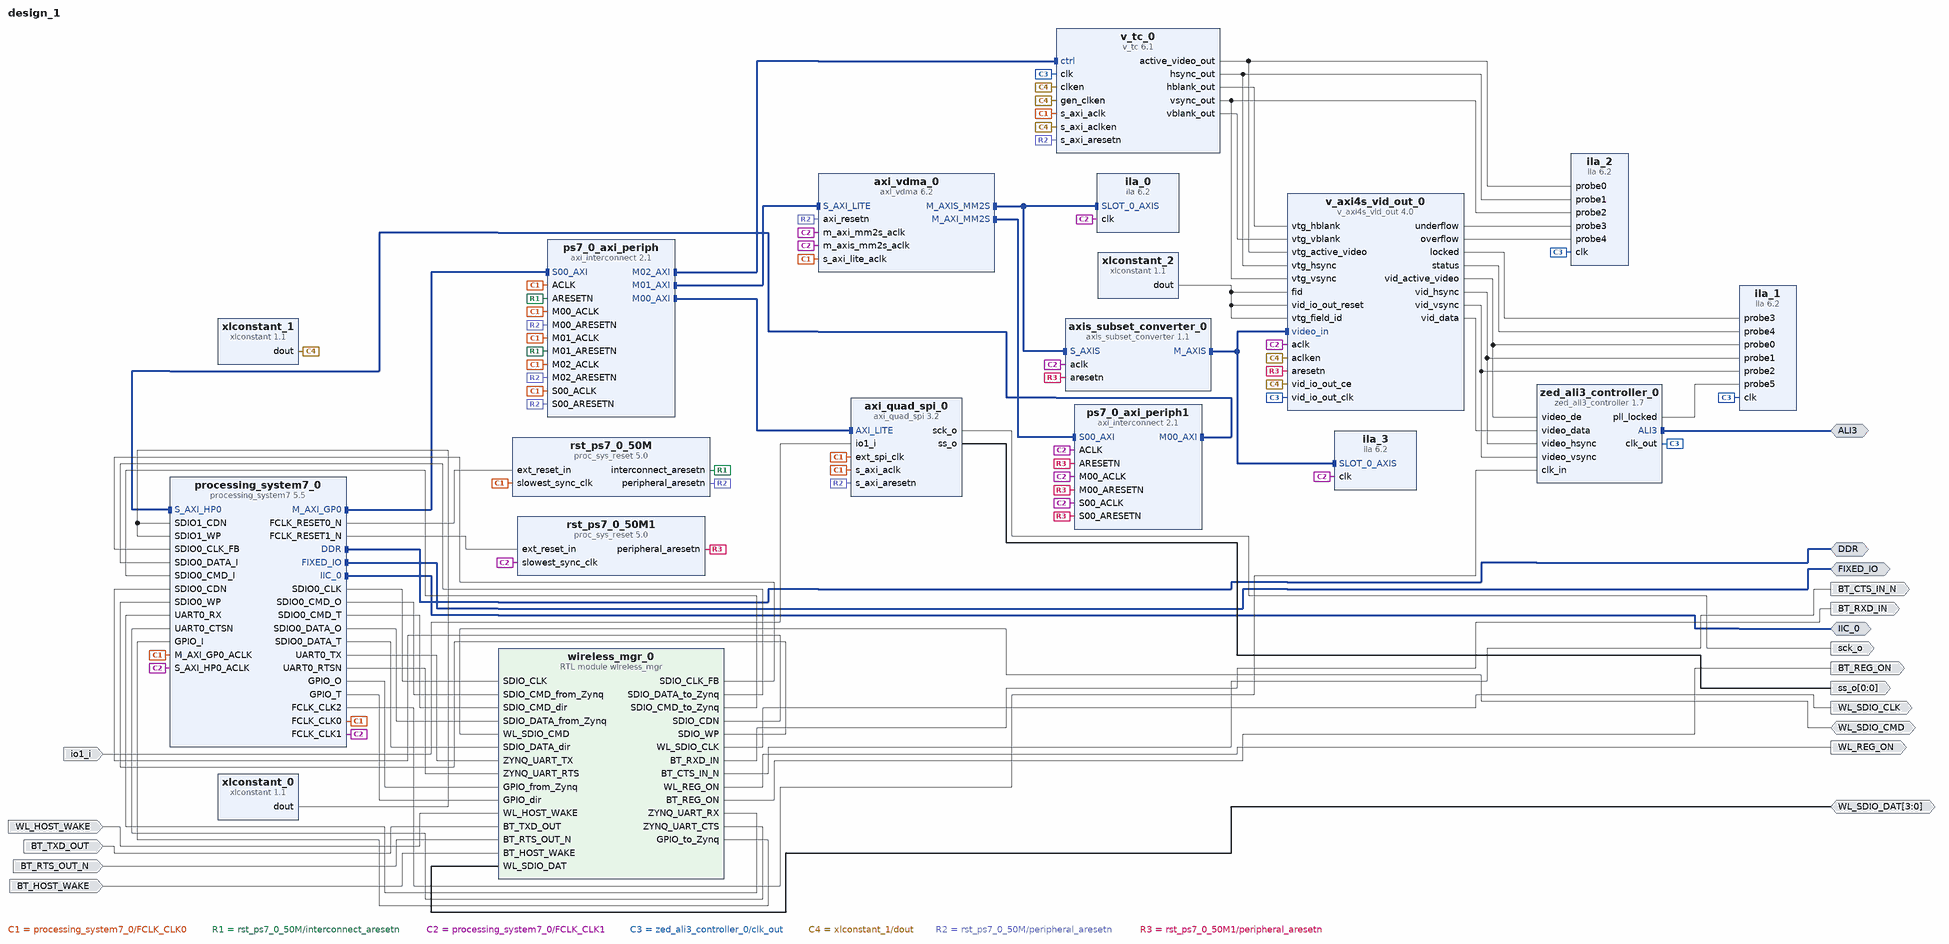
[diagram p0: block diagram of the top level]
# Vivado block design design_1, xc7z007sclg225-1, Vivado 2016.4
create_bd_design design_1

create_bd_intf_port -mode Master -vlnv xilinx.com:interface:ddrx_rtl:1.0 DDR
create_bd_intf_port -mode Master -vlnv xilinx.com:display_processing_system7:fixedio_rtl:1.0 FIXED_IO
create_bd_intf_port -mode Master -vlnv xilinx.com:interface:iic_rtl:1.0 IIC_0
create_bd_intf_port -mode Master -vlnv avnet.com:interface:avnet_ali3_rtl:1.0 ALI3
create_bd_port -dir I WL_HOST_WAKE
create_bd_port -dir I BT_TXD_OUT
create_bd_port -dir I BT_RTS_OUT_N
create_bd_port -dir I BT_HOST_WAKE
create_bd_port -dir O -type clk WL_SDIO_CLK
create_bd_port -dir IO WL_SDIO_CMD
create_bd_port -dir IO -from 3 -to 0 WL_SDIO_DAT
create_bd_port -dir O WL_REG_ON
create_bd_port -dir O BT_RXD_IN
create_bd_port -dir O BT_CTS_IN_N
create_bd_port -dir O BT_REG_ON
create_bd_port -dir I io1_i
create_bd_port -dir O sck_o
create_bd_port -dir O -from 0 -to 0 ss_o

create_bd_cell -type ip -vlnv xilinx.com:ip:processing_system7:5.5 processing_system7_0
set_property -dict [list \
  CONFIG.PCW_FCLK_CLK1_BUF TRUE \
  CONFIG.PCW_FCLK_CLK2_BUF TRUE \
  CONFIG.PCW_FCLK_CLK3_BUF TRUE \
  CONFIG.PCW_UIPARAM_DDR_FREQ_MHZ 533.333333 \
  CONFIG.PCW_APU_PERIPHERAL_FREQMHZ 666.666666 \
  CONFIG.PCW_SDIO_PERIPHERAL_FREQMHZ 25 \
  CONFIG.PCW_UART_PERIPHERAL_FREQMHZ 100 \
  CONFIG.PCW_I2C_PERIPHERAL_FREQMHZ 111.111115 \
  CONFIG.PCW_FPGA0_PERIPHERAL_FREQMHZ 50 \
  CONFIG.PCW_FPGA1_PERIPHERAL_FREQMHZ 50 \
  CONFIG.PCW_FPGA2_PERIPHERAL_FREQMHZ 33.3333 \
  CONFIG.PCW_FPGA3_PERIPHERAL_FREQMHZ 200 \
  CONFIG.PCW_USE_S_AXI_HP0 1 \
  CONFIG.PCW_USE_FABRIC_INTERRUPT 1 \
  CONFIG.PCW_GPIO_EMIO_GPIO_WIDTH 4 \
  CONFIG.PCW_DQ_WIDTH 16 \
  CONFIG.PCW_DQS_WIDTH 2 \
  CONFIG.PCW_DM_WIDTH 2 \
  CONFIG.PCW_MIO_PRIMITIVE 32 \
  CONFIG.PCW_EN_CLK1_PORT 1 \
  CONFIG.PCW_EN_CLK2_PORT 1 \
  CONFIG.PCW_EN_CLK3_PORT 1 \
  CONFIG.PCW_EN_RST1_PORT 1 \
  CONFIG.PCW_EN_RST2_PORT 1 \
  CONFIG.PCW_IRQ_F2P_INTR 1 \
  CONFIG.PCW_PRESET_BANK1_VOLTAGE {LVCMOS 3.3V} \
  CONFIG.PCW_UIPARAM_DDR_MEMORY_TYPE {DDR 3 (Low Voltage)} \
  CONFIG.PCW_UIPARAM_DDR_BUS_WIDTH {16 Bit} \
  CONFIG.PCW_UIPARAM_DDR_PARTNO {MT41K256M16 RE-125} \
  CONFIG.PCW_QSPI_PERIPHERAL_ENABLE 1 \
  CONFIG.PCW_QSPI_QSPI_IO {MIO 1 .. 6} \
  CONFIG.PCW_QSPI_GRP_SINGLE_SS_ENABLE 1 \
  CONFIG.PCW_QSPI_GRP_SINGLE_SS_IO {MIO 1 .. 6} \
  CONFIG.PCW_QSPI_GRP_FBCLK_ENABLE 1 \
  CONFIG.PCW_QSPI_GRP_FBCLK_IO {MIO 8} \
  CONFIG.PCW_ENET0_PERIPHERAL_ENABLE 0 \
  CONFIG.PCW_SD0_PERIPHERAL_ENABLE 1 \
  CONFIG.PCW_SD0_SD0_IO EMIO \
  CONFIG.PCW_SD1_PERIPHERAL_ENABLE 1 \
  CONFIG.PCW_SD1_SD1_IO {MIO 10 .. 15} \
  CONFIG.PCW_SD1_GRP_CD_ENABLE 1 \
  CONFIG.PCW_SD1_GRP_WP_ENABLE 1 \
  CONFIG.PCW_UART0_PERIPHERAL_ENABLE 1 \
  CONFIG.PCW_UART0_UART0_IO EMIO \
  CONFIG.PCW_UART0_GRP_FULL_ENABLE 1 \
  CONFIG.PCW_UART0_GRP_FULL_IO EMIO \
  CONFIG.PCW_UART1_PERIPHERAL_ENABLE 1 \
  CONFIG.PCW_UART1_UART1_IO {MIO 48 .. 49} \
  CONFIG.PCW_USB0_PERIPHERAL_ENABLE 1 \
  CONFIG.PCW_USB0_USB0_IO {MIO 28 .. 39} \
  CONFIG.PCW_USB_RESET_ENABLE 1 \
  CONFIG.PCW_USB_RESET_SELECT {Share reset pin} \
  CONFIG.PCW_USB0_RESET_ENABLE 1 \
  CONFIG.PCW_USB0_RESET_IO {MIO 7} \
  CONFIG.PCW_I2C0_PERIPHERAL_ENABLE 1 \
  CONFIG.PCW_I2C0_I2C0_IO EMIO \
  CONFIG.PCW_I2C_RESET_ENABLE 1 \
  CONFIG.PCW_I2C_RESET_SELECT {Share reset pin} \
  CONFIG.PCW_GPIO_MIO_GPIO_ENABLE 1 \
  CONFIG.PCW_GPIO_MIO_GPIO_IO MIO \
  CONFIG.PCW_GPIO_EMIO_GPIO_ENABLE 1 \
  CONFIG.PCW_GPIO_EMIO_GPIO_IO 4 \
  CONFIG.PCW_FPGA_FCLK1_ENABLE 1 \
] [get_bd_cells processing_system7_0]
# 297 more settings of processing_system7_0 are not shown: defaults, MIO pin electricals, DDR timing, and values the tool derives
create_bd_cell -type module -reference wireless_mgr wireless_mgr_0
create_bd_cell -type ip -vlnv xilinx.com:ip:axi_interconnect:2.1 ps7_0_axi_periph
set_property -dict {CONFIG.NUM_MI 3} [get_bd_cells ps7_0_axi_periph]
create_bd_cell -type ip -vlnv xilinx.com:ip:proc_sys_reset:5.0 rst_ps7_0_50M
create_bd_cell -type ip -vlnv xilinx.com:ip:xlconstant:1.1 xlconstant_0
set_property -dict {CONFIG.CONST_VAL 0} [get_bd_cells xlconstant_0]
create_bd_cell -type ip -vlnv xilinx.com:ip:axi_quad_spi:3.2 axi_quad_spi_0
set_property -dict {CONFIG.C_USE_STARTUP 0 CONFIG.C_NUM_TRANSFER_BITS 16 CONFIG.Multiples16 1} [get_bd_cells axi_quad_spi_0]
create_bd_cell -type ip -vlnv xilinx.com:ip:axi_vdma:6.2 axi_vdma_0
set_property -dict [list \
  CONFIG.c_m_axis_mm2s_tdata_width 32 \
  CONFIG.c_num_fstores 1 \
  CONFIG.c_use_mm2s_fsync 0 \
  CONFIG.c_mm2s_genlock_mode 0 \
  CONFIG.c_mm2s_linebuffer_depth 4096 \
  CONFIG.c_mm2s_max_burst_length 16 \
  CONFIG.c_include_s2mm 0 \
  CONFIG.c_include_mm2s_dre 1 \
] [get_bd_cells axi_vdma_0]
create_bd_cell -type ip -vlnv xilinx.com:ip:axi_interconnect:2.1 ps7_0_axi_periph1
set_property -dict {CONFIG.NUM_MI 1} [get_bd_cells ps7_0_axi_periph1]
create_bd_cell -type ip -vlnv xilinx.com:ip:v_axi4s_vid_out:4.0 v_axi4s_vid_out_0
set_property -dict {CONFIG.C_HAS_ASYNC_CLK 1 CONFIG.C_ADDR_WIDTH 13 CONFIG.C_VTG_MASTER_SLAVE 1} [get_bd_cells v_axi4s_vid_out_0]
create_bd_cell -type ip -vlnv avnet.com:ip:zed_ali3_controller:1.7 zed_ali3_controller_0
set_property -dict {CONFIG.C_PIXEL_CLOCK_RATE 1 CONFIG.C_DATA_WIDTH 24} [get_bd_cells zed_ali3_controller_0]
create_bd_cell -type ip -vlnv xilinx.com:ip:ila:6.2 ila_0
set_property -dict {CONFIG.C_DATA_DEPTH 8192 CONFIG.C_NUM_OF_PROBES 9 CONFIG.C_SLOT_0_AXI_PROTOCOL AXI4S} [get_bd_cells ila_0]
create_bd_cell -type ip -vlnv xilinx.com:ip:ila:6.2 ila_1
set_property -dict [list \
  CONFIG.C_PROBE4_WIDTH 32 \
  CONFIG.C_NUM_OF_PROBES 6 \
  CONFIG.C_SLOT_0_AXI_PROTOCOL AXI4S \
  CONFIG.C_ENABLE_ILA_AXI_MON false \
  CONFIG.C_MONITOR_TYPE Native \
] [get_bd_cells ila_1]
create_bd_cell -type ip -vlnv xilinx.com:ip:v_tc:6.1 v_tc_0
set_property -dict {CONFIG.enable_detection false CONFIG.enable_generation true} [get_bd_cells v_tc_0]
create_bd_cell -type ip -vlnv xilinx.com:ip:xlconstant:1.1 xlconstant_1
create_bd_cell -type ip -vlnv xilinx.com:ip:proc_sys_reset:5.0 rst_ps7_0_50M1
create_bd_cell -type ip -vlnv xilinx.com:ip:axis_subset_converter:1.1 axis_subset_converter_0
set_property -dict [list \
  CONFIG.S_TDATA_NUM_BYTES 4 \
  CONFIG.M_TDATA_NUM_BYTES 3 \
  CONFIG.S_TUSER_WIDTH 1 \
  CONFIG.M_TUSER_WIDTH 1 \
  CONFIG.S_HAS_TKEEP 1 \
  CONFIG.S_HAS_TLAST 1 \
  CONFIG.M_HAS_TKEEP 1 \
  CONFIG.M_HAS_TLAST 1 \
  CONFIG.TDATA_REMAP {tdata[23:16],tdata[7:0],tdata[15:8]} \
  CONFIG.TUSER_REMAP {tuser[0:0]} \
  CONFIG.TKEEP_REMAP {tkeep[2:0]} \
  CONFIG.TLAST_REMAP {tlast[0]} \
] [get_bd_cells axis_subset_converter_0]
create_bd_cell -type ip -vlnv xilinx.com:ip:ila:6.2 ila_2
set_property -dict [list \
  CONFIG.C_PROBE4_WIDTH 1 \
  CONFIG.C_NUM_OF_PROBES 5 \
  CONFIG.C_SLOT_0_AXI_PROTOCOL AXI4S \
  CONFIG.C_ENABLE_ILA_AXI_MON false \
  CONFIG.C_MONITOR_TYPE Native \
] [get_bd_cells ila_2]
create_bd_cell -type ip -vlnv xilinx.com:ip:ila:6.2 ila_3
set_property -dict {CONFIG.C_DATA_DEPTH 8192 CONFIG.C_NUM_OF_PROBES 9 CONFIG.C_SLOT_0_AXI_PROTOCOL AXI4S} [get_bd_cells ila_3]
create_bd_cell -type ip -vlnv xilinx.com:ip:xlconstant:1.1 xlconstant_2
set_property -dict {CONFIG.CONST_VAL 0} [get_bd_cells xlconstant_2]

# ---- connections ----

connect_bd_intf_net [get_bd_intf_pins processing_system7_0/M_AXI_GP0] [get_bd_intf_pins ps7_0_axi_periph/S00_AXI]
connect_bd_intf_net [get_bd_intf_pins ps7_0_axi_periph/M00_AXI] [get_bd_intf_pins axi_quad_spi_0/AXI_LITE]
connect_bd_intf_net [get_bd_intf_pins ps7_0_axi_periph/M01_AXI] [get_bd_intf_pins axi_vdma_0/S_AXI_LITE]
connect_bd_intf_net [get_bd_intf_pins ps7_0_axi_periph1/M00_AXI] [get_bd_intf_pins processing_system7_0/S_AXI_HP0]
connect_bd_intf_net [get_bd_intf_pins ps7_0_axi_periph1/S00_AXI] [get_bd_intf_pins axi_vdma_0/M_AXI_MM2S]
connect_bd_intf_net [get_bd_intf_pins ps7_0_axi_periph/M02_AXI] [get_bd_intf_pins v_tc_0/ctrl]
connect_bd_intf_net [get_bd_intf_pins axi_vdma_0/M_AXIS_MM2S] [get_bd_intf_pins axis_subset_converter_0/S_AXIS]
connect_bd_intf_net [get_bd_intf_pins axi_vdma_0/M_AXIS_MM2S] [get_bd_intf_pins ila_0/SLOT_0_AXIS]
connect_bd_intf_net [get_bd_intf_pins axis_subset_converter_0/M_AXIS] [get_bd_intf_pins v_axi4s_vid_out_0/video_in]
connect_bd_intf_net [get_bd_intf_pins axis_subset_converter_0/M_AXIS] [get_bd_intf_pins ila_3/SLOT_0_AXIS]
connect_bd_intf_net [get_bd_intf_ports DDR] [get_bd_intf_pins processing_system7_0/DDR]
connect_bd_intf_net [get_bd_intf_ports FIXED_IO] [get_bd_intf_pins processing_system7_0/FIXED_IO]
connect_bd_intf_net [get_bd_intf_ports IIC_0] [get_bd_intf_pins processing_system7_0/IIC_0]
connect_bd_intf_net [get_bd_intf_ports ALI3] [get_bd_intf_pins zed_ali3_controller_0/ALI3]
connect_bd_net [get_bd_pins processing_system7_0/FCLK_CLK0] \
  [get_bd_pins processing_system7_0/M_AXI_GP0_ACLK] [get_bd_pins rst_ps7_0_50M/slowest_sync_clk] \
  [get_bd_pins axi_quad_spi_0/s_axi_aclk] [get_bd_pins axi_quad_spi_0/ext_spi_clk] [get_bd_pins axi_vdma_0/s_axi_lite_aclk] \
  [get_bd_pins v_tc_0/s_axi_aclk] [get_bd_pins ps7_0_axi_periph/S00_ACLK] [get_bd_pins ps7_0_axi_periph/ACLK] \
  [get_bd_pins ps7_0_axi_periph/M00_ACLK] [get_bd_pins ps7_0_axi_periph/M01_ACLK] [get_bd_pins ps7_0_axi_periph/M02_ACLK]
connect_bd_net [get_bd_pins processing_system7_0/FCLK_RESET0_N] [get_bd_pins rst_ps7_0_50M/ext_reset_in]
connect_bd_net [get_bd_pins rst_ps7_0_50M/interconnect_aresetn] [get_bd_pins ps7_0_axi_periph/ARESETN] [get_bd_pins ps7_0_axi_periph/M01_ARESETN]
connect_bd_net [get_bd_pins processing_system7_0/SDIO0_CLK] [get_bd_pins wireless_mgr_0/SDIO_CLK]
connect_bd_net [get_bd_pins processing_system7_0/SDIO0_CMD_O] [get_bd_pins wireless_mgr_0/SDIO_CMD_from_Zynq]
connect_bd_net [get_bd_pins processing_system7_0/SDIO0_CMD_T] [get_bd_pins wireless_mgr_0/SDIO_CMD_dir]
connect_bd_net [get_bd_pins processing_system7_0/SDIO0_DATA_O] [get_bd_pins wireless_mgr_0/SDIO_DATA_from_Zynq]
connect_bd_net [get_bd_pins processing_system7_0/SDIO0_DATA_T] [get_bd_pins wireless_mgr_0/SDIO_DATA_dir]
connect_bd_net [get_bd_pins processing_system7_0/UART0_TX] [get_bd_pins wireless_mgr_0/ZYNQ_UART_TX]
connect_bd_net [get_bd_pins processing_system7_0/UART0_RTSN] [get_bd_pins wireless_mgr_0/ZYNQ_UART_RTS]
connect_bd_net [get_bd_pins processing_system7_0/GPIO_O] [get_bd_pins wireless_mgr_0/GPIO_from_Zynq]
connect_bd_net [get_bd_pins processing_system7_0/GPIO_T] [get_bd_pins wireless_mgr_0/GPIO_dir]
connect_bd_net [get_bd_ports WL_HOST_WAKE] [get_bd_pins wireless_mgr_0/WL_HOST_WAKE]
connect_bd_net [get_bd_ports BT_TXD_OUT] [get_bd_pins wireless_mgr_0/BT_TXD_OUT]
connect_bd_net [get_bd_ports BT_RTS_OUT_N] [get_bd_pins wireless_mgr_0/BT_RTS_OUT_N]
connect_bd_net [get_bd_ports BT_HOST_WAKE] [get_bd_pins wireless_mgr_0/BT_HOST_WAKE]
connect_bd_net [get_bd_pins wireless_mgr_0/SDIO_CLK_FB] [get_bd_pins processing_system7_0/SDIO0_CLK_FB]
connect_bd_net [get_bd_pins wireless_mgr_0/SDIO_DATA_to_Zynq] [get_bd_pins processing_system7_0/SDIO0_DATA_I]
connect_bd_net [get_bd_pins wireless_mgr_0/SDIO_CMD_to_Zynq] [get_bd_pins processing_system7_0/SDIO0_CMD_I]
connect_bd_net [get_bd_pins wireless_mgr_0/SDIO_CDN] [get_bd_pins processing_system7_0/SDIO0_CDN]
connect_bd_net [get_bd_pins wireless_mgr_0/SDIO_WP] [get_bd_pins processing_system7_0/SDIO0_WP]
connect_bd_net [get_bd_pins wireless_mgr_0/ZYNQ_UART_RX] [get_bd_pins processing_system7_0/UART0_RX]
connect_bd_net [get_bd_pins wireless_mgr_0/ZYNQ_UART_CTS] [get_bd_pins processing_system7_0/UART0_CTSN]
connect_bd_net [get_bd_pins wireless_mgr_0/GPIO_to_Zynq] [get_bd_pins processing_system7_0/GPIO_I]
connect_bd_net [get_bd_pins wireless_mgr_0/WL_SDIO_CLK] [get_bd_ports WL_SDIO_CLK]
connect_bd_net [get_bd_ports WL_SDIO_CMD] [get_bd_pins wireless_mgr_0/WL_SDIO_CMD]
connect_bd_net [get_bd_ports WL_SDIO_DAT] [get_bd_pins wireless_mgr_0/WL_SDIO_DAT]
connect_bd_net [get_bd_pins wireless_mgr_0/WL_REG_ON] [get_bd_ports WL_REG_ON]
connect_bd_net [get_bd_pins wireless_mgr_0/BT_RXD_IN] [get_bd_ports BT_RXD_IN]
connect_bd_net [get_bd_pins wireless_mgr_0/BT_CTS_IN_N] [get_bd_ports BT_CTS_IN_N]
connect_bd_net [get_bd_pins wireless_mgr_0/BT_REG_ON] [get_bd_ports BT_REG_ON]
connect_bd_net [get_bd_pins xlconstant_0/dout] [get_bd_pins processing_system7_0/SDIO1_WP] [get_bd_pins processing_system7_0/SDIO1_CDN]
connect_bd_net [get_bd_ports io1_i] [get_bd_pins axi_quad_spi_0/io1_i]
connect_bd_net [get_bd_pins axi_quad_spi_0/sck_o] [get_bd_ports sck_o]
connect_bd_net [get_bd_pins axi_quad_spi_0/ss_o] [get_bd_ports ss_o]
connect_bd_net [get_bd_pins processing_system7_0/FCLK_CLK1] \
  [get_bd_pins axi_vdma_0/m_axi_mm2s_aclk] [get_bd_pins axi_vdma_0/m_axis_mm2s_aclk] [get_bd_pins v_axi4s_vid_out_0/aclk] \
  [get_bd_pins ila_0/clk] [get_bd_pins processing_system7_0/S_AXI_HP0_ACLK] [get_bd_pins rst_ps7_0_50M1/slowest_sync_clk] \
  [get_bd_pins axis_subset_converter_0/aclk] [get_bd_pins ila_3/clk] [get_bd_pins ps7_0_axi_periph1/ACLK] \
  [get_bd_pins ps7_0_axi_periph1/S00_ACLK] [get_bd_pins ps7_0_axi_periph1/M00_ACLK]
connect_bd_net [get_bd_pins v_axi4s_vid_out_0/vid_active_video] [get_bd_pins ila_1/probe0] [get_bd_pins zed_ali3_controller_0/video_de]
connect_bd_net [get_bd_pins v_axi4s_vid_out_0/vid_hsync] [get_bd_pins ila_1/probe1] [get_bd_pins zed_ali3_controller_0/video_hsync]
connect_bd_net [get_bd_pins v_axi4s_vid_out_0/vid_vsync] [get_bd_pins ila_1/probe2] [get_bd_pins zed_ali3_controller_0/video_vsync]
connect_bd_net [get_bd_pins v_axi4s_vid_out_0/locked] [get_bd_pins ila_1/probe3]
connect_bd_net [get_bd_pins v_axi4s_vid_out_0/status] [get_bd_pins ila_1/probe4]
connect_bd_net [get_bd_pins v_axi4s_vid_out_0/vid_data] [get_bd_pins zed_ali3_controller_0/video_data]
connect_bd_net [get_bd_pins zed_ali3_controller_0/pll_locked] [get_bd_pins ila_1/probe5]
connect_bd_net [get_bd_pins zed_ali3_controller_0/clk_out] \
  [get_bd_pins v_axi4s_vid_out_0/vid_io_out_clk] [get_bd_pins ila_1/clk] [get_bd_pins v_tc_0/clk] [get_bd_pins ila_2/clk]
connect_bd_net [get_bd_pins processing_system7_0/FCLK_CLK2] [get_bd_pins zed_ali3_controller_0/clk_in]
connect_bd_net [get_bd_pins xlconstant_1/dout] \
  [get_bd_pins v_tc_0/s_axi_aclken] [get_bd_pins v_tc_0/clken] [get_bd_pins v_axi4s_vid_out_0/vid_io_out_ce] \
  [get_bd_pins v_axi4s_vid_out_0/aclken] [get_bd_pins v_tc_0/gen_clken]
connect_bd_net [get_bd_pins rst_ps7_0_50M/peripheral_aresetn] \
  [get_bd_pins axi_quad_spi_0/s_axi_aresetn] [get_bd_pins v_tc_0/s_axi_aresetn] [get_bd_pins axi_vdma_0/axi_resetn] \
  [get_bd_pins ps7_0_axi_periph/S00_ARESETN] [get_bd_pins ps7_0_axi_periph/M00_ARESETN] \
  [get_bd_pins ps7_0_axi_periph/M02_ARESETN]
connect_bd_net [get_bd_pins processing_system7_0/FCLK_RESET1_N] [get_bd_pins rst_ps7_0_50M1/ext_reset_in]
connect_bd_net [get_bd_pins rst_ps7_0_50M1/peripheral_aresetn] \
  [get_bd_pins v_axi4s_vid_out_0/aresetn] [get_bd_pins axis_subset_converter_0/aresetn] \
  [get_bd_pins ps7_0_axi_periph1/ARESETN] [get_bd_pins ps7_0_axi_periph1/S00_ARESETN] \
  [get_bd_pins ps7_0_axi_periph1/M00_ARESETN]
connect_bd_net [get_bd_pins v_tc_0/active_video_out] [get_bd_pins ila_2/probe0] [get_bd_pins v_axi4s_vid_out_0/vtg_active_video]
connect_bd_net [get_bd_pins v_tc_0/hsync_out] [get_bd_pins ila_2/probe1] [get_bd_pins v_axi4s_vid_out_0/vtg_hsync]
connect_bd_net [get_bd_pins v_tc_0/vsync_out] [get_bd_pins ila_2/probe2] [get_bd_pins v_axi4s_vid_out_0/vtg_vsync]
connect_bd_net [get_bd_pins v_tc_0/hblank_out] [get_bd_pins v_axi4s_vid_out_0/vtg_hblank]
connect_bd_net [get_bd_pins v_tc_0/vblank_out] [get_bd_pins v_axi4s_vid_out_0/vtg_vblank]
connect_bd_net [get_bd_pins v_axi4s_vid_out_0/underflow] [get_bd_pins ila_2/probe3]
connect_bd_net [get_bd_pins v_axi4s_vid_out_0/overflow] [get_bd_pins ila_2/probe4]
connect_bd_net [get_bd_pins xlconstant_2/dout] \
  [get_bd_pins v_axi4s_vid_out_0/fid] [get_bd_pins v_axi4s_vid_out_0/vid_io_out_reset] \
  [get_bd_pins v_axi4s_vid_out_0/vtg_field_id]

# ---- address map ----
assign_bd_address -offset 0x00000000 -range 512M -target_address_space [get_bd_addr_spaces axi_vdma_0/Data_MM2S] [get_bd_addr_segs processing_system7_0/S_AXI_HP0/HP0_DDR_LOWOCM]
assign_bd_address -offset 0x41E00000 -range 64K -target_address_space [get_bd_addr_spaces processing_system7_0/Data] [get_bd_addr_segs axi_quad_spi_0/AXI_LITE/Reg]
assign_bd_address -offset 0x43000000 -range 64K -target_address_space [get_bd_addr_spaces processing_system7_0/Data] [get_bd_addr_segs axi_vdma_0/S_AXI_LITE/Reg]
assign_bd_address -offset 0x43C00000 -range 64K -target_address_space [get_bd_addr_spaces processing_system7_0/Data] [get_bd_addr_segs v_tc_0/ctrl/Reg]

validate_bd_design
save_bd_design
